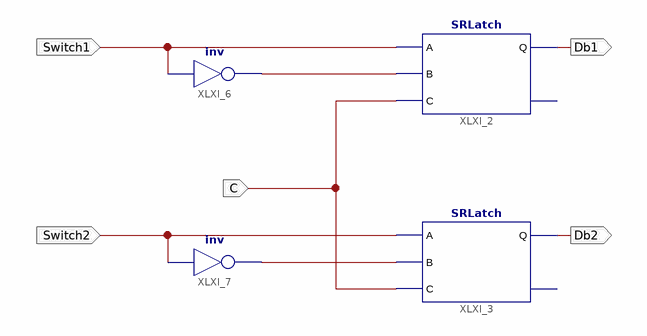
[diagram p0: schematic sheet 1]
// Xilinx ISE schematic SwitchDebounce.sch (spartan6) as structural Verilog: 4 symbols, 5 ports
module SwitchDebounce (
  input  C,
  input  Switch1,
  input  Switch2,
  output Db1,
  output Db2
);

  wire XLXN_10, XLXN_12;

  SRLatch XLXI_2 (.A(Switch1), .B(XLXN_10), .C(C), .Q(Db1));  // open: NotQ
  SRLatch XLXI_3 (.A(Switch2), .B(XLXN_12), .C(C), .Q(Db2));  // open: NotQ
  not XLXI_6 (XLXN_10, Switch1);
  not XLXI_7 (XLXN_12, Switch2);
endmodule
